# EAGLE schematic tottag (EAGLE 9.6.2)
AUTHOR: Andreas Biri & Pat Pannuto; REV: H; TITLE: TotTag

## Sheet 1 of 5: nRF8240
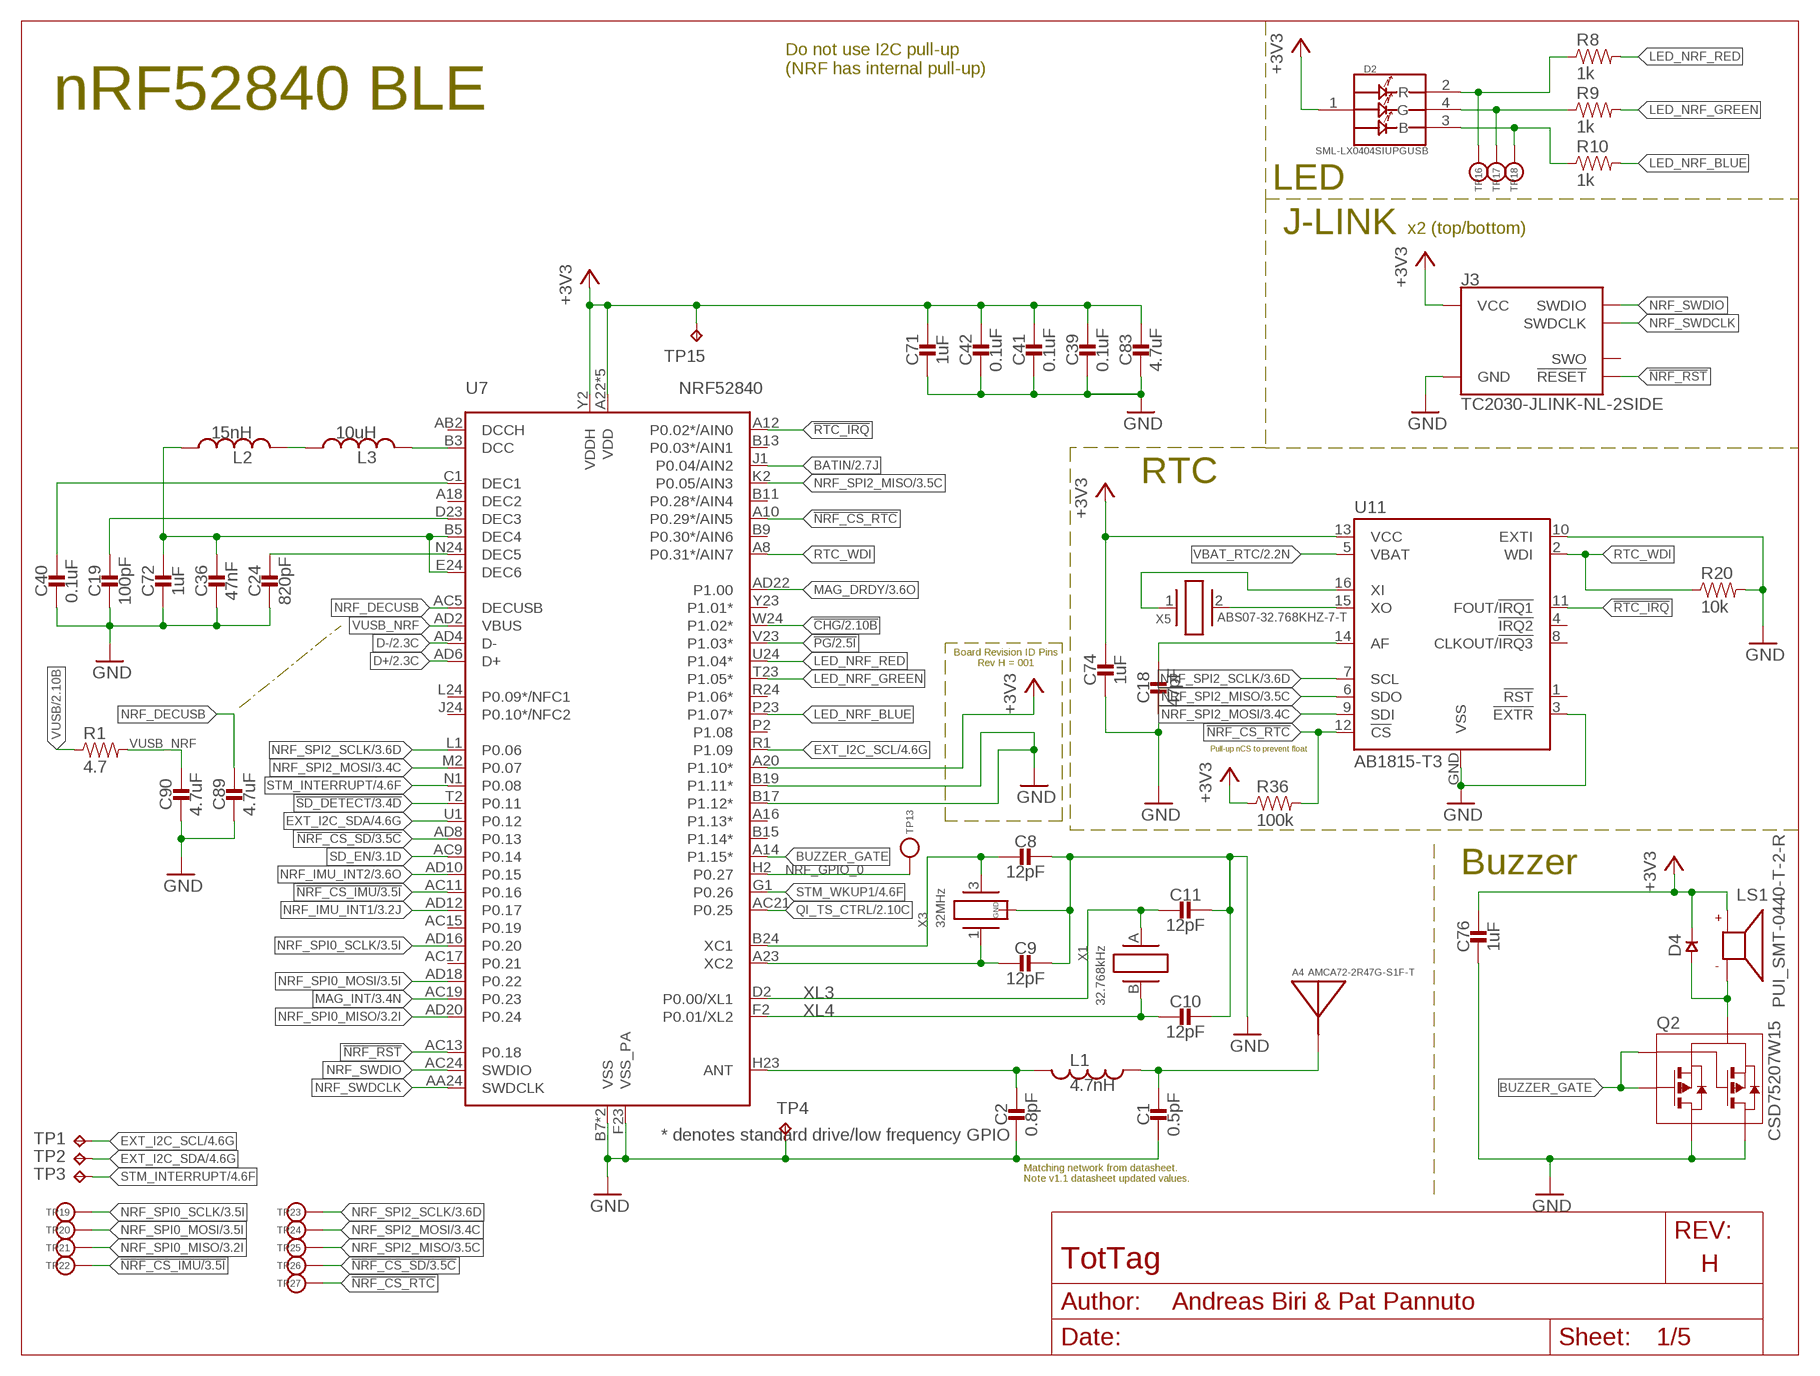
[diagram p0: schematic, sheet 1]

### Parts
A4  AMCA72-2R47G-S1F-T  [AMCA72-2R470G-S1F-T]
C1  0.5pF  CAPACITOR0402_CAP  [0402_CAP]
C2  0.8pF  CAPACITOR0402_CAP  [0402_CAP]
C8  12pF  CAPACITOR0402_CAP  [0402_CAP]
C9  12pF  CAPACITOR0402_CAP  [0402_CAP]
C10  12pF  CAPACITOR0402_CAP  [0402_CAP]
C11  12pF  CAPACITOR0402_CAP  [0402_CAP]
C18  47pF  CAPACITOR0402_CAP  [0402_CAP]
C19  100pF  CAPACITOR0402_CAP  [0402_CAP]
C24  820pF  CAPACITOR0402_CAP  [0402_CAP]
C36  47nF  CAPACITOR0402_CAP  [0402_CAP]
C39  0.1uF  CAPACITOR0402_CAP  [0402_CAP]
C40  0.1uF  CAPACITOR0402_CAP  [0402_CAP]
C41  0.1uF  CAPACITOR0402_CAP  [0402_CAP]
C42  0.1uF  CAPACITOR0402_CAP  [0402_CAP]
C71  1uF  CAPACITOR0402_CAP  [0402_CAP]
C72  1uF  CAPACITOR0402_CAP  [0402_CAP]
C74  1uF  CAPACITOR0402_CAP  [0402_CAP]
C76  1uF  CAPACITOR0402_CAP  [0402_CAP]
C83  4.7uF  CAPACITOR0402_CAP  [0402_CAP]
C89  4.7uF  CAPACITOR0402_CAP  [0402_CAP]
C90  4.7uF  CAPACITOR0402_CAP  [0402_CAP]
D2  SML-LX0404SIUPGUSB  [1MM_SQ_4PAD]
D4  DIODE0402  [0402_DIODE]
J3  TC2030-JLINK-NL-2SIDE  [TC2030-IDC-NL-2SIDE]
L1  4.7nH  INDUCTOR0402  [0402_CAP]
L2  15nH  INDUCTOR0402  [0402_CAP]
L3  10uH  INDUCTOR0603  [0603_CAP]
LS1  PUI_SMT-0440-T-2-R  [SMT-0440-T-2-R]
Q2  CSD75207W15  [DSBGA]
R1  4.7  RESISTOR0402_RES  [0402_RES]
R8  1k  RESISTOR0402_RES  [0402_RES]
R9  1k  RESISTOR0402_RES  [0402_RES]
R10  1k  RESISTOR0402_RES  [0402_RES]
R20  10k  RESISTOR0402_RES  [0402_RES]
R36  100k  RESISTOR0402_RES  [0402_RES]
TP1  TPTP06SQ  [TP06SQ]
TP2  TPTP06SQ  [TP06SQ]
TP3  TPTP06SQ  [TP06SQ]
TP4  TPTP06SQ  [TP06SQ]
TP13  TEST-POINT  [PAD.03X.03]
TP15  TPTP06SQ  [TP06SQ]
TP16  TEST-POINT  [PAD.03X.03]
TP17  TEST-POINT  [PAD.03X.03]
TP18  TEST-POINT  [PAD.03X.03]
TP19  TEST-POINT  [PAD.03X.03]
TP20  TEST-POINT  [PAD.03X.03]
TP21  TEST-POINT  [PAD.03X.03]
TP22  TEST-POINT  [PAD.03X.03]
TP23  TEST-POINT  [PAD.03X.03]
TP24  TEST-POINT  [PAD.03X.03]
TP25  TEST-POINT  [PAD.03X.03]
TP26  TEST-POINT  [PAD.03X.03]
TP27  TEST-POINT  [PAD.03X.03]
U7  NRF52840  [AQFN73]
U11  AB1815-T3  [QFN-16-3MM]
X1  32.768kHz  ABS05-32.768KHZ-9-T  [ABS05]
X3  32MHz  7V-32.000MAHV-T  [TXC-7V]
X5  ABS07-32.768KHZ-7-T  [ABS07]

### Nets
!CHG: U7.W24(P1.02*) ; also sheet 2
!NRF_CS_IMU: TP22.P$1(TESTPOINT) U7.AC11(P0.16) ; also sheet 3
!NRF_CS_RTC: R36.2 TP27.P$1(TESTPOINT) U7.A10(P0.29*/AIN5) U11.12(!CS)
!NRF_CS_SD: TP26.P$1(TESTPOINT) U7.AD8(P0.13) ; also sheet 3
!NRF_RST: J3.3(!RESET) J3.B3(!RESET) U7.AC13(P0.18)
!PG: U7.V23(P1.03*) ; also sheet 2
!RTC_IRQ: U7.A12(P0.02*/AIN0) U11.11(FOUT/!IRQ1)
!SD_DETECT: U7.T2(P0.11) ; also sheet 3
+3V3: C39.1 C41.1 C42.1 C71.1 C74.1 C76.1 C83.1 D2.1(VDD) D4.CATHODE J3.1(VCC) J3.B1(VCC) LS1.+(P) R36.1 TP15.TP U7.A20(P1.10*) U7.A22(VDD) U7.AD14(VDD) U7.AD23(VDD) U7.B1(VDD) U7.W1(VDD) U7.Y2(VDDH) U11.13(VCC) ; also sheet 2,3,4,5
BATIN: U7.J1(P0.04/AIN2) ; also sheet 2
BLE_ANT: A4.S1(ANTENNA) C1.1 L1.1
BUZZER_GATE: Q2.A1(G1) Q2.C1(G2) U7.A14(P1.15*)
D+: U7.AD6(D+) ; also sheet 2
D-: U7.AD4(D-) ; also sheet 2
EXT_I2C_SCL: TP1.TP U7.R1(P1.09) ; also sheet 4,5
EXT_I2C_SDA: TP2.TP U7.U1(P0.12) ; also sheet 4,5
GND: C1.2 C2.2 C8.1 C9.1 C10.1 C11.1 C18.2 C19.2 C24.2 C36.2 C39.2 C40.2 C41.2 C42.2 C71.2 C72.2 C74.2 C76.2 C83.2 C89.2 C90.2 J3.5(GND) J3.B5(GND) Q2.A2(D1) Q2.A3(D1) Q2.B2(D2) Q2.B3(D1) Q2.C2(D2) Q2.C3(D2) R20.2 TP4.TP U7.B7(VSS) U7.B17(P1.12*) U7.B19(P1.11*) U7.F23(VSS_PA) U7.GND(VSS) U11.3(!EXTR) U11.10(EXTI) U11.GND(VSS) X3.2(GND) X3.4(GND) ; also sheet 2,3,4
LED_NRF_BLUE: R10.2 U7.P23(P1.07*)
LED_NRF_BLUE_COMM: D2.3(B) R10.1 TP18.P$1(TESTPOINT)
LED_NRF_GREEN: R9.2 U7.T23(P1.05*)
LED_NRF_GREEN_COMM: D2.4(G) R9.1 TP17.P$1(TESTPOINT)
LED_NRF_RED: R8.2 U7.U24(P1.04*)
LED_NRF_RED_COMM: D2.2(R) R8.1 TP16.P$1(TESTPOINT)
MAG_DRDY: U7.AD22(P1.00) ; also sheet 3
MAG_INT: U7.AC19(P0.23) ; also sheet 3
N$2: D4.ANODE LS1.-(N) Q2.B1(S)
N$15: C2.1 L1.2 U7.H23(ANT)
N$18: C8.2 U7.B24(XC1) X3.3
N$19: C9.2 U7.A23(XC2) X3.1
N$35: C18.1 U11.14(AF)
N$37: L2.2 L3.1
N$41: U11.16(XI) X5.1
N$42: U11.15(XO) X5.2
NRF_DCC: L3.2 U7.B3(DCC)
NRF_DECAP1: C40.1 U7.C1(DEC1)
NRF_DECAP3: C19.1 U7.D23(DEC3)
NRF_DECAP5: C24.1 U7.N24(DEC5)
NRF_DECAP46: C36.1 C72.1 L2.1 U7.B5(DEC4) U7.E24(DEC6)
NRF_DECUSB: C89.1 U7.AC5(DECUSB)
NRF_GPIO_0: TP13.P$1(TESTPOINT) U7.H2(P0.27)
NRF_IMU_INT1: U7.AD12(P0.17) ; also sheet 3
NRF_IMU_INT2: U7.AD10(P0.15) ; also sheet 3
NRF_SPI0_MISO: TP21.P$1(TESTPOINT) U7.AD20(P0.24) ; also sheet 3
NRF_SPI0_MOSI: TP20.P$1(TESTPOINT) U7.AD18(P0.22) ; also sheet 3
NRF_SPI0_SCLK: TP19.P$1(TESTPOINT) U7.AD16(P0.20) ; also sheet 3
NRF_SPI2_MISO: TP25.P$1(TESTPOINT) U7.K2(P0.05/AIN3) U11.6(SDO) ; also sheet 3
NRF_SPI2_MOSI: TP24.P$1(TESTPOINT) U7.M2(P0.07) U11.9(SDI) ; also sheet 3
NRF_SPI2_SCLK: TP23.P$1(TESTPOINT) U7.L1(P0.06) U11.7(SCL) ; also sheet 3
NRF_SWDCLK: J3.4(SWDCLK) J3.B4(SWDCLK) U7.AA24(SWDCLK)
NRF_SWDIO: J3.2(SWDIO) J3.B2(SWDIO) U7.AC24(SWDIO)
QI_TS_CTRL: U7.AC21(P0.25) ; also sheet 2
RTC_WDI: R20.1 U7.A8(P0.31*/AIN7) U11.2(WDI)
SD_EN: U7.AC9(P0.14) ; also sheet 3
STM_INTERRUPT: TP3.TP U7.N1(P0.08) ; also sheet 4,5
STM_WKUP1: U7.G1(P0.26) ; also sheet 4
VBAT_RTC: U11.5(VBAT) ; also sheet 2
VUSB: R1.1 ; also sheet 2
VUSB_NRF: C90.1 R1.2 U7.AD2(VBUS)
XL3: C11.2 U7.D2(P0.00/XL1) X1.A
XL4: C10.2 U7.F2(P0.01/XL2) X1.B
Unconnected: J3.6(SWO) J3.B6(SWO) U7.A16(P1.13*) U7.A18(DEC2) U7.AB2(DCCH) U7.AC15(P0.19) U7.AC17(P0.21) U7.B9(P0.30*/AIN6) U7.B11(P0.28*/AIN4) U7.B13(P0.03*/AIN1) U7.B15(P1.14*) U7.J24(P0.10*/NFC2) U7.L24(P0.09*/NFC1) U7.P2(P1.08) U7.R24(P1.06*) U7.Y23(P1.01*) U11.1(!RST) U11.4(!IRQ2) U11.8(CLKOUT/!IRQ3)

### Notes on the sheet
- Do not use I2C pull-up
  (NRF has internal pull-up)
- nRF52840 BLE
- LED
- J-LINK | x2 (top/bottom)
- RTC
- Board Revision ID Pins
  Rev H = 001
- Pull-up nCS to prevent float
- Buzzer
- Matching network from datasheet.
  Note v1.1 datasheet updated values.

## Sheet 2 of 5: Power
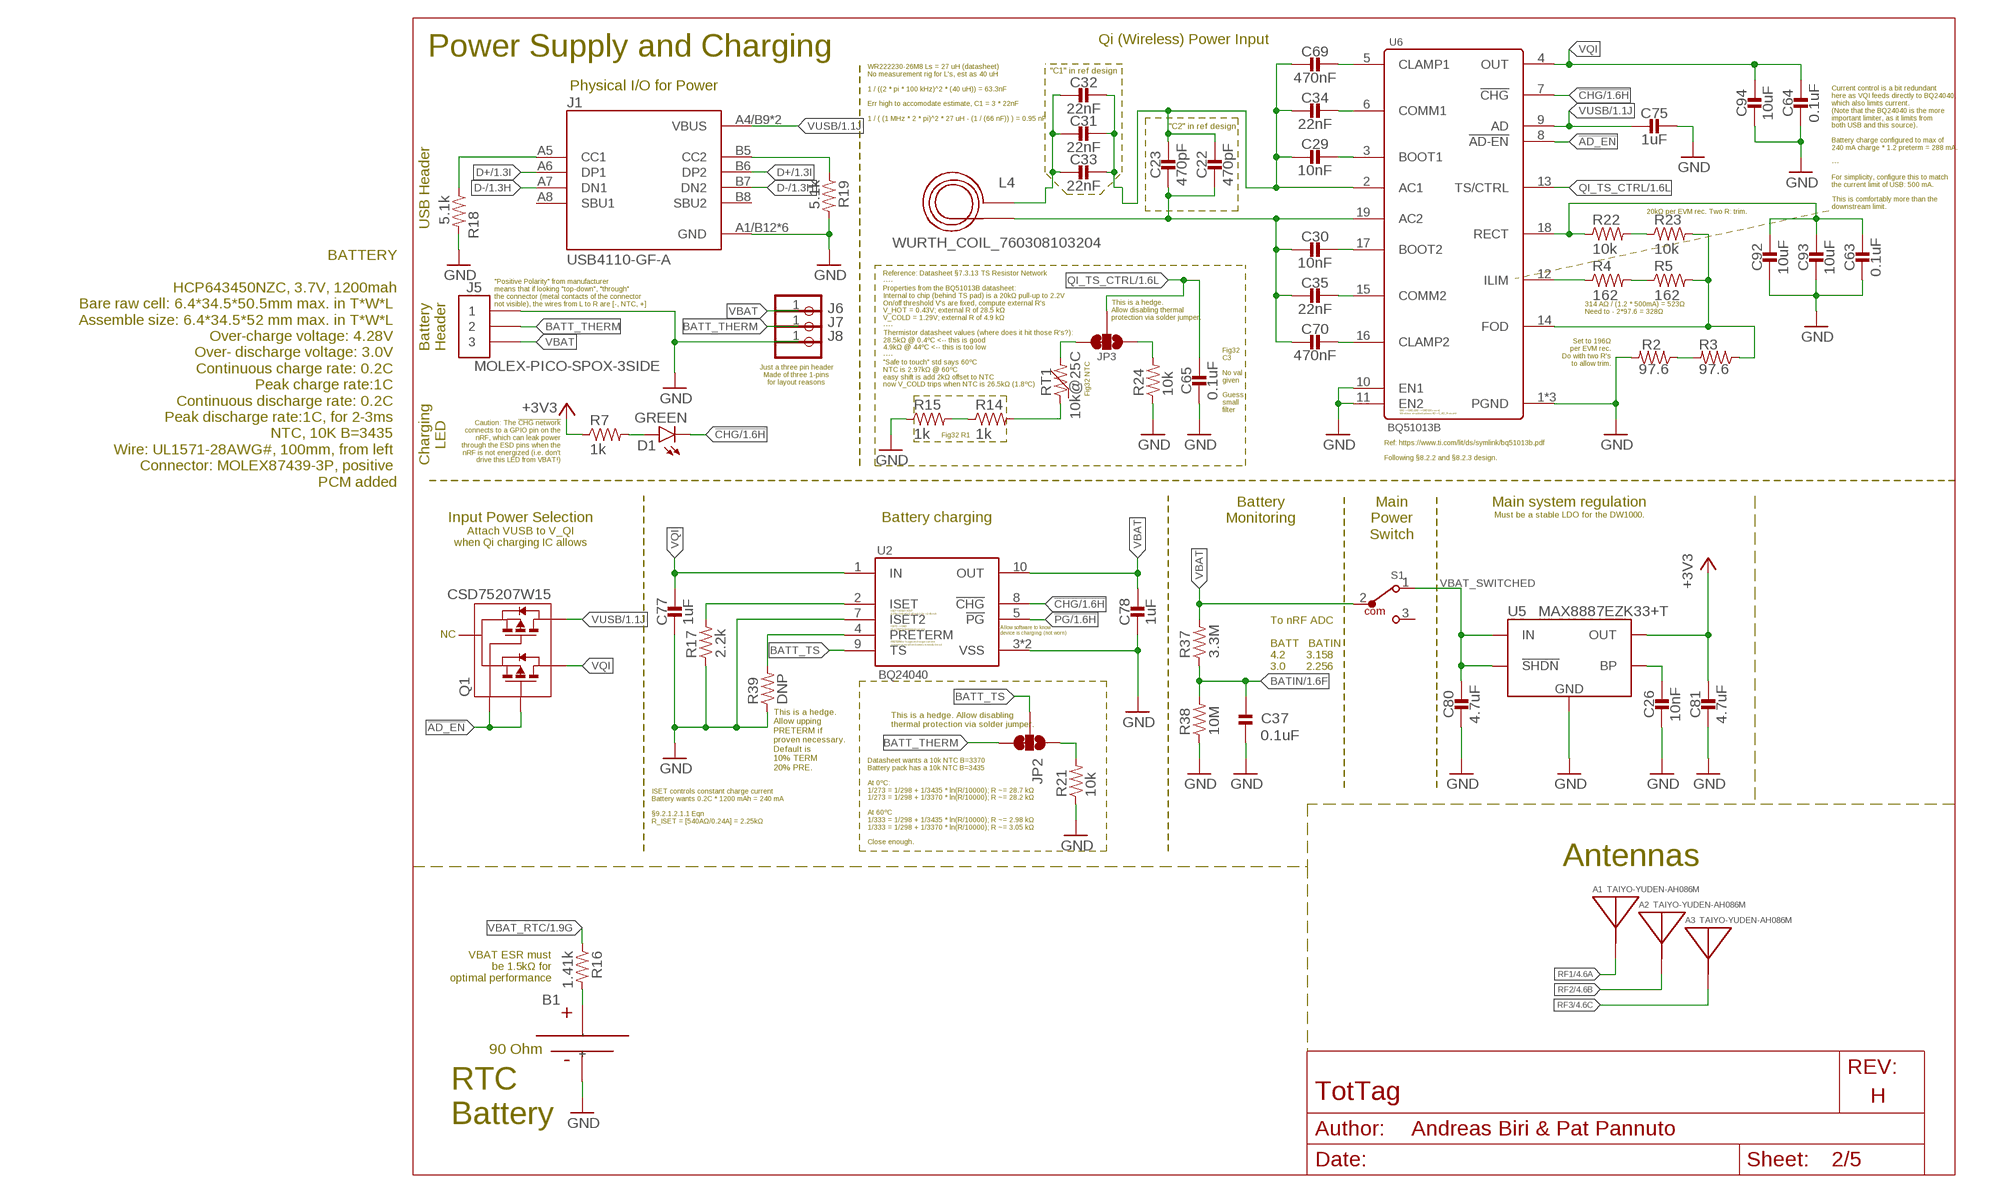
[diagram p1: schematic, sheet 2]

### Parts
A1  TAIYO-YUDEN-AH086M  [TAIYO-YUDEN-AH086M]
A2  TAIYO-YUDEN-AH086M  [TAIYO-YUDEN-AH086M]
A3  TAIYO-YUDEN-AH086M  [TAIYO-YUDEN-AH086M]
B1  MS518SE  [MS518SE-FL35E]
C22  470pF  CAPACITOR0402_CAP  [0402_CAP]
C23  470pF  CAPACITOR0402_CAP  [0402_CAP]
C26  10nF  CAPACITOR0402_CAP  [0402_CAP]
C29  10nF  CAPACITOR0402_CAP  [0402_CAP]
C30  10nF  CAPACITOR0402_CAP  [0402_CAP]
C31  22nF  CAPACITOR0402_CAP  [0402_CAP]
C32  22nF  CAPACITOR0402_CAP  [0402_CAP]
C33  22nF  CAPACITOR0402_CAP  [0402_CAP]
C34  22nF  CAPACITOR0402_CAP  [0402_CAP]
C35  22nF  CAPACITOR0402_CAP  [0402_CAP]
C37  0.1uF  CAPACITOR0402_CAP  [0402_CAP]
C63  0.1uF  CAPACITOR0402_CAP  [0402_CAP]
C64  0.1uF  CAPACITOR0402_CAP  [0402_CAP]
C65  0.1uF  CAPACITOR0402_CAP  [0402_CAP]
C69  470nF  CAPACITOR0402_CAP  [0402_CAP]
C70  470nF  CAPACITOR0402_CAP  [0402_CAP]
C75  1uF  CAPACITOR0402_CAP  [0402_CAP]
C77  1uF  CAPACITOR0402_CAP  [0402_CAP]
C78  1uF  CAPACITOR0402_CAP  [0402_CAP]
C80  4.7uF  CAPACITOR0402_CAP  [0402_CAP]
C81  4.7uF  CAPACITOR0402_CAP  [0402_CAP]
C92  10uF  CAPACITOR0603_CAP  [0603_CAP]
C93  10uF  CAPACITOR0603_CAP  [0603_CAP]
C94  10uF  CAPACITOR0603_CAP  [0603_CAP]
D1  GREEN  LED0603  [LED-0603]
J1  USB4110-GF-A  [GCT_USB4110-GF-A]
J5  MOLEX-PICO-SPOX-3SIDE  [MOLEX-PICO-SPOX-3_SIDE]
J6  PINHD-1X1  [1X01]
J7  PINHD-1X1  [1X01]
J8  PINHD-1X1  [1X01]
JP2  JUMPER-SMT_3_1-NC_TRACE_SILK  [SMT-JUMPER_3_1-NC_TRACE_SILK]
JP3  JUMPER-SMT_3_1-NC_TRACE_SILK  [SMT-JUMPER_3_1-NC_TRACE_SILK]
L4  WURTH_COIL_760308103204  [WURTH_COIL_760308103204]
Q1  CSD75207W15  [DSBGA]
R2  97.6  RESISTOR0402_RES  [0402_RES]
R3  97.6  RESISTOR0402_RES  [0402_RES]
R4  162  RESISTOR0402_RES  [0402_RES]
R5  162  RESISTOR0402_RES  [0402_RES]
R7  1k  RESISTOR0402_RES  [0402_RES]
R14  1k  RESISTOR0402_RES  [0402_RES]
R15  1k  RESISTOR0402_RES  [0402_RES]
R16  1.41k  RESISTOR0402_RES  [0402_RES]
R17  2.2k  RESISTOR0402_RES  [0402_RES]
R18  5.1k  RESISTOR0402_RES  [0402_RES]
R19  5.1k  RESISTOR0402_RES  [0402_RES]
R21  10k  RESISTOR0402_RES  [0402_RES]
R22  10k  RESISTOR0402_RES  [0402_RES]
R23  10k  RESISTOR0402_RES  [0402_RES]
R24  10k  RESISTOR0402_RES  [0402_RES]
R37  3.3M  RESISTOR0402_RES  [0402_RES]
R38  10M  RESISTOR0402_RES  [0402_RES]
R39  DNP  RESISTOR0402_RES  [0402_RES]
RT1  10k@25C  THERMISTOR0402  [0402_RES]
S1  450404015514  [450404015514]
U2  BQ24040  [DSQ0010A]
U5  MAX8887EZK33+T  [SOT-23-5]
U6  BQ51013B  [RHL0020A]

### Nets
!AD_EN: Q1.A1(G1) Q1.C1(G2) U6.8(!AD-EN)
!CHG: D1.C U2.8(!CHG) U6.7(!CHG) ; also sheet 1
!PG: U2.5(!PG) ; also sheet 1
+3V3: C81.1 R7.1 U5.5(OUT) ; also sheet 1,3,4,5
BATIN: C37.2 R37.1 R38.2 ; also sheet 1
BATT_THERM: J5.2 J5.2SUPP J7.1 JP2.3
BATT_TS: JP2.2 U2.9(TS)
BQ_AC1: C22.1 C23.1 C29.2 C31.1 C32.1 C33.1 C34.2 C69.2 U6.2(AC1)
BQ_AC2: C22.2 C23.2 C30.2 C35.2 C70.2 L4.P$2 U6.19(AC2)
BQ_BOOT1: C29.1 U6.3(BOOT1)
BQ_BOOT2: C30.1 U6.17(BOOT2)
BQ_CLAMP1: C69.1 U6.5(CLAMP1)
BQ_CLAMP2: C70.1 U6.16(CLAMP2)
BQ_COMM1: C34.1 U6.6(COMM1)
BQ_COMM2: C35.1 U6.15(COMM2)
BQ_FOD: R3.1 R5.2 R23.2 U6.14(FOD)
BQ_ILM: R4.1 U6.12(ILIM)
BQ_RECT: C63.1 C92.1 C93.1 R22.1 U6.18(RECT)
COIL_AC1: C31.2 C32.2 C33.2 L4.P$1
D+: J1.A6(DP1) J1.B6(DP2) ; also sheet 1
D-: J1.A7(DN1) J1.B7(DN2) ; also sheet 1
GND: B1.- C26.2 C37.1 C63.2 C64.2 C65.2 C75.1 C77.2 C78.2 C80.2 C81.2 C92.2 C93.2 C94.2 J1.A1/B12(GND) J1.B1/A12(GND) J1.S1(GND) J1.S2(GND) J1.S3(GND) J1.S4(GND) J5.1 J5.1SUPP J8.1 R2.2 R15.1 R17.1 R18.2 R19.2 R21.1 R24.1 R38.1 R39.1 U2.3(VSS) U2.7(ISET2) U2.PAD(VSS) U5.2(GND) U6.1(PGND) U6.10(EN1) U6.11(EN2) U6.20(PGND) U6.PAD(PGND) ; also sheet 1,3,4
N$1: J1.B5(CC2) R19.1
N$11: C26.1 U5.4(BP)
N$13: J1.A5(CC1) R18.1
N$28: R2.1 R3.2
N$34: R17.2 U2.2(ISET)
N$45: B1.+ R16.2
N$47: JP2.1 R21.2
N$49: R39.2 U2.4(PRETERM)
N$54: D1.A R7.2
N$64: R22.2 R23.1
N$66: R4.2 R5.1
N$67: JP3.1 R24.2
N$68: JP3.3 RT1.2
N$69: R14.2 RT1.1
N$70: R14.1 R15.2
QI_TS_CTRL: C65.1 JP3.2 U6.13(TS/CTRL) ; also sheet 1
RF1: A1.A(ANTENNA) ; also sheet 4,5
RF2: A2.A(ANTENNA) ; also sheet 4,5
RF3: A3.A(ANTENNA) ; also sheet 4,5
VBAT: C78.1 J5.3 J5.3SUPP J6.1 R37.2 S1.2 U2.10(OUT)
VBAT_RTC: R16.1 ; also sheet 1
VBAT_SWITCHED: C80.1 S1.1 U5.1(IN) U5.3(!SHDN)
VQI: C64.1 C77.1 C94.1 Q1.A2(D1) Q1.A3(D1) Q1.B3(D1) U2.1(IN) U6.4(OUT)
VUSB: C75.2 J1.A4/B9(VBUS) J1.B4/A9(VBUS) Q1.B2(D2) Q1.C2(D2) Q1.C3(D2) U6.9(AD) ; also sheet 1
Unconnected: J1.A8(SBU1) J1.B8(SBU2) Q1.B1(S) S1.3

### Notes on the sheet
- Power Supply and Charging | Qi (Wireless) Power Input
- WR222230-26M8 Ls = 27 uH (datasheet)
  No measurement rig for L's, est as 40 uH
  
  1 / ((2 * pi * 100 kHz)^2 * (40 uH)) = 63.3nF
  
  Err high to accomodate estimate, C1 = 3 * 22nF
  
  1 / ( (1 MHz * 2 * pi)^2 * 27 uH - (1 / (66 nF)) ) = 0.95 nF
- "C1" in ref design
- Physical I/O for Power
- "C2" in ref design
- USB Header
- 20kΩ per EVM rec. Two R: trim.
- Current control is a bit redundant
  here as VQI feeds directly to BQ24040,
  which also limits current.
  (Note that the BQ24040 is the more
  important limiter, as it limits from
  both USB and this source).
  
  Battery charge configured to max of
  240 mA charge * 1.2 preterm = 288 mA.
  
  ---
  
  For simplicity, configure this to match
  the current limit of USB: 500 mA.
  
  This is comfortably more than the
  downstream limit.
- BATTERY
  
  HCP643450NZC, 3.7V, 1200mah
  Bare raw cell: 6.4*34.5*50.5mm max. in T*W*L 
  Assemble size: 6.4*34.5*52 mm max. in T*W*L 
  Over-charge voltage: 4.28V 
  Over- discharge voltage: 3.0V 
  Continuous charge rate: 0.2C 
  Peak charge rate:1C 
  Continuous discharge rate: 0.2C 
  Peak discharge rate:1C, for 2-3ms 
  NTC, 10K B=3435 
  Wire: UL1571-28AWG#, 100mm, from left 
  Connector: MOLEX87439-3P, positive 
  PCM added
- Reference: Datasheet §7.3.13 TS Resistor Network
  ----
  Properties from the BQ51013B datasheet:
  Internal to chip (behind TS pad) is a 20kΩ pull-up to 2.2V
  On/off threshold V's are fixed, compute external R's
  V_HOT = 0.43V; external R of 28.5 kΩ
  V_COLD = 1.29V; external R of 4.9 kΩ
  ----
  Thermistor datasheet values (where does it hit those R's?):
  28.5kΩ @ 0.4ºC <-- this is good
  4.9kΩ @ 44ºC <-- this is too low
  ----
  "Safe to touch" std says 60ºC
  NTC is 2.97kΩ @ 60ºC
  easy shift is add 2kΩ offset to NTC
  now V_COLD trips when NTC is 26.5kΩ (1.8ºC)
- This is a hedge.
  Allow disabling thermal
  protection via solder jumper.
- 314 AΩ / (1.2 * 500mA) = 523Ω
  Need to - 2*97.6 = 328Ω
- "Positive Polarity" from manufacturer
  means that if looking "top-down", "through"
  the connector (metal contacts of the connector
  not visible), the wires from L to R are [-, NTC, +]
- Battery
  Header
- Set to 196Ω
  per EVM rec.
  Do with two R's
  to allow trim.
- Fig32
  C3
  
  No val
  given
  
  Guess
  small
  filter
- Just a three pin header
  Made of three 1-pins
  for layout reasons
- Fig32 NTC
- EN1 -> GND, EN2 -> GND [00 case]
  Wireless enabled unless AD > V_AD_Present
- Caution: The !CHG network
  connects to a GPIO pin on the
  nRF, which can leak power
  through the ESD pins when the
  nRF is not energized (i.e. don't
  drive this LED from VBAT!)
- Fig32 R1
- Charging
  LED
- Ref: https://www.ti.com/lit/ds/symlink/bq51013b.pdf
  
  Following §8.2.2 and §8.2.3 design.
- Battery
  Monitoring
- Main
  Power
  Switch
- Main system regulation
- Input Power Selection | Battery charging | Must be a stable LDO for the DW1000.
- Attach VUSB to V_QI
  when Qi charging IC allows
- ISET = KISET / IOUT
  2.25k = 540 AΩ / 240 mA; 2.2k -> 245 mA
- ISET2 -> GND
  Use ISET to limit input current
- Allow software to know
  device is charging (not worn)
- NC
- PRETERM is %age of charge current
  system uses when battery is totally dead
- To nRF ADC
  
  BATT   BATIN
  4.2       3.158
  3.0       2.256
- This is a hedge.
  Allow upping
  PRETERM if
  proven necessary.
  Default is
  10% TERM
  20% PRE.
- This is a hedge. Allow disabling
  thermal protection via solder jumper.
- Datasheet wants a 10k NTC B=3370
  Battery pack has a 10k NTC B=3435
  
  At 0ºC:
  1/273 = 1/298 + 1/3435 * ln(R/10000); R ~= 28.7 kΩ
  1/273 = 1/298 + 1/3370 * ln(R/10000); R ~= 28.2 kΩ
  
  At 60ºC
  1/333 = 1/298 + 1/3435 * ln(R/10000); R ~= 2.98 kΩ
  1/333 = 1/298 + 1/3370 * ln(R/10000); R ~= 3.05 kΩ
  
  Close enough.
- ISET controls constant charge current
  Battery wants 0.2C * 1200 mAh = 240 mA
  
  §9.2.1.2.1.1 Eqn
  R_ISET = [540AΩ/0.24A] = 2.25kΩ
- Antennas
- VBAT ESR must
  be 1.5kΩ for
  optimal performance
- 90 Ohm
- RTC
  Battery

## Sheet 3 of 5: SD Card + Sensors
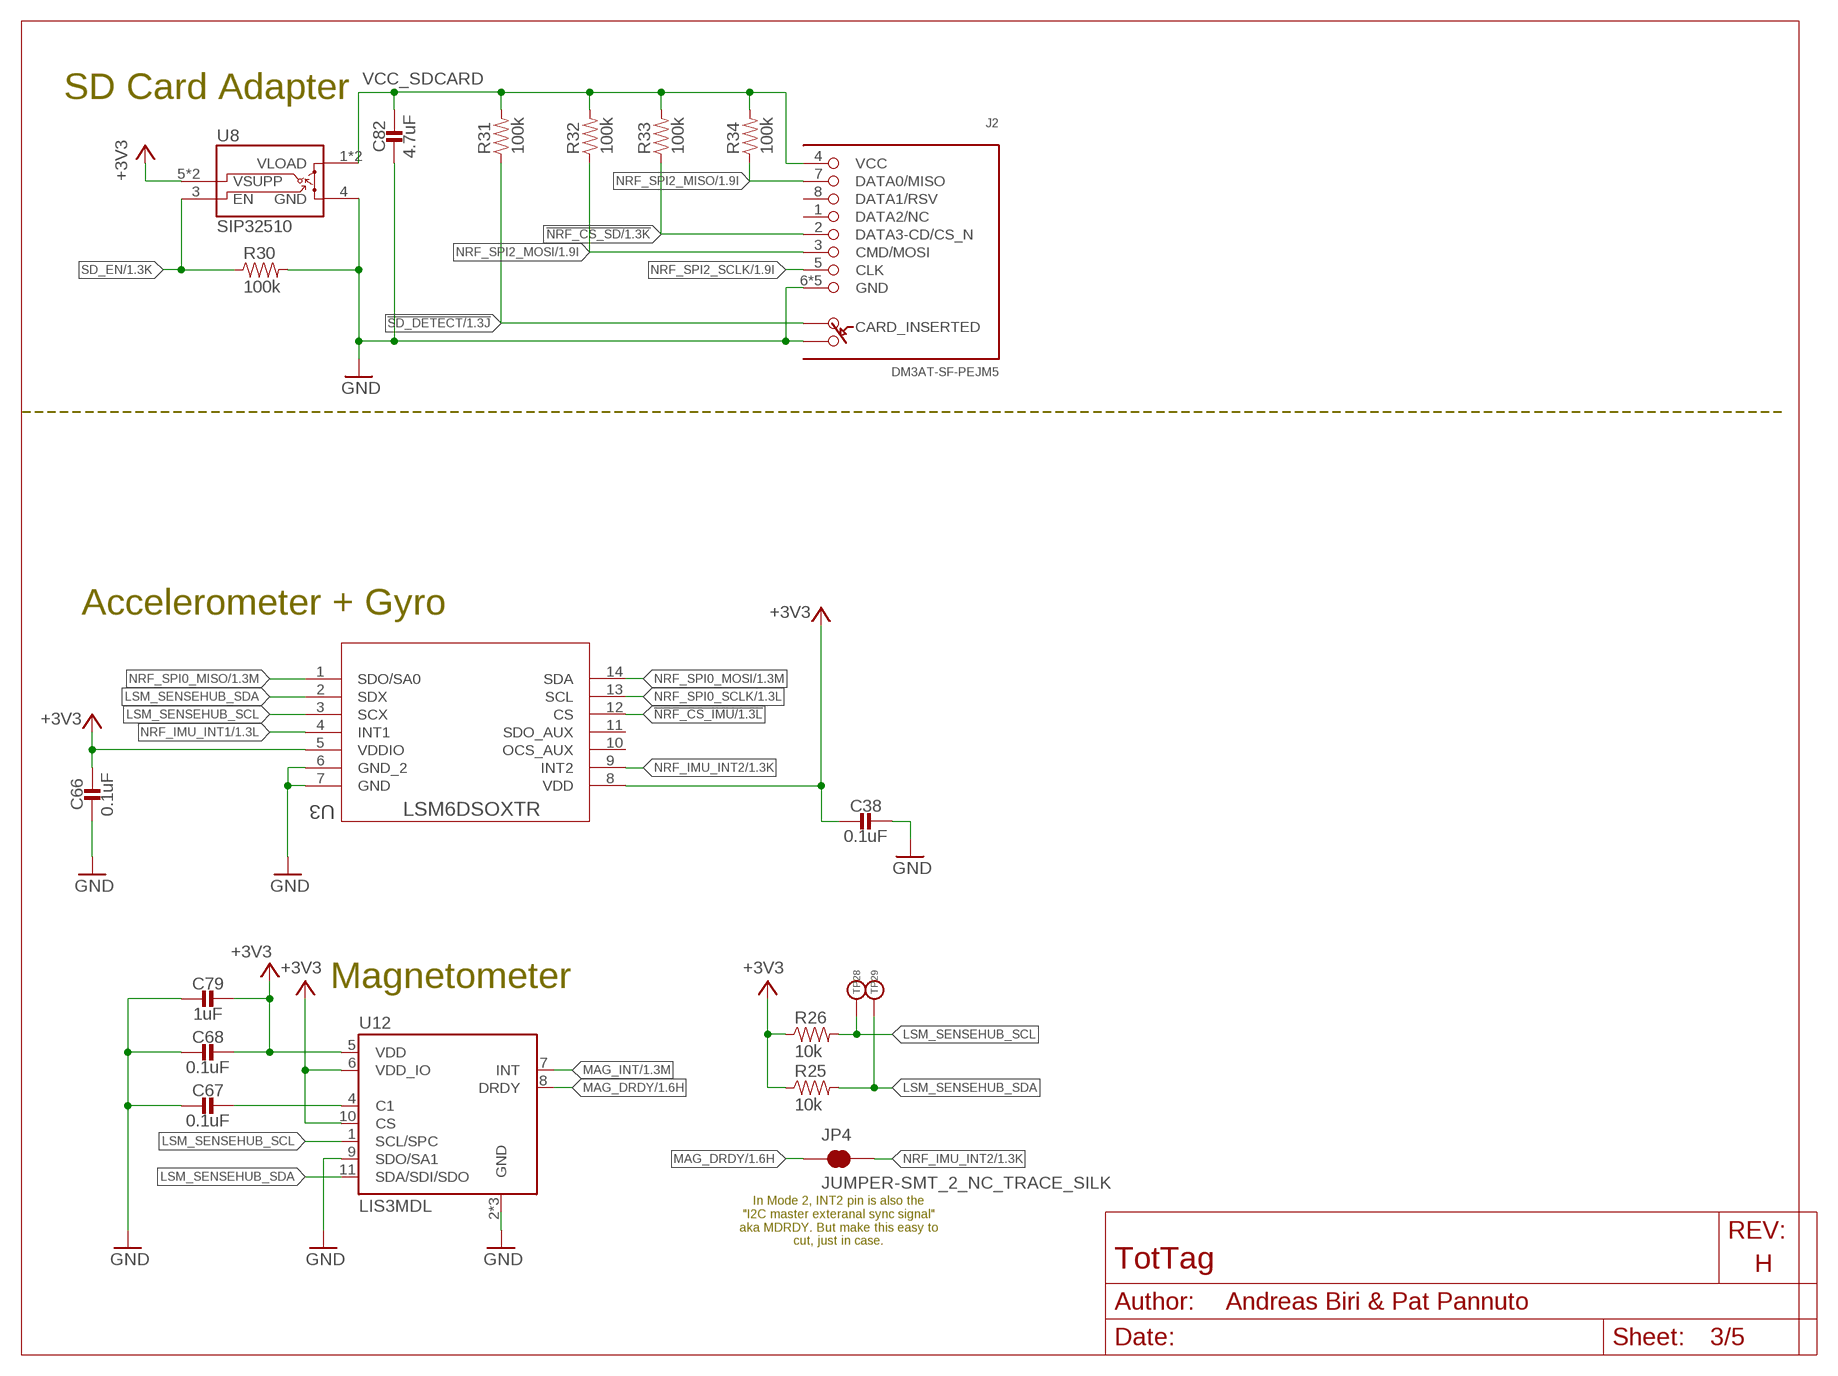
[diagram p2: schematic, sheet 3]

### Parts
C38  0.1uF  CAPACITOR0402_CAP  [0402_CAP]
C66  0.1uF  CAPACITOR0402_CAP  [0402_CAP]
C67  0.1uF  CAPACITOR0402_CAP  [0402_CAP]
C68  0.1uF  CAPACITOR0402_CAP  [0402_CAP]
C79  1uF  CAPACITOR0402_CAP  [0402_CAP]
C82  4.7uF  CAPACITOR0402_CAP  [0402_CAP]
J2  DM3AT-SF-PEJM5  [DM3AT-SF-PEJM5]
JP4  JUMPER-SMT_2_NC_TRACE_SILK  [SMT-JUMPER_2_NC_TRACE_SILK]
R25  10k  RESISTOR0402_RES  [0402_RES]
R26  10k  RESISTOR0402_RES  [0402_RES]
R30  100k  RESISTOR0402_RES  [0402_RES]
R31  100k  RESISTOR0402_RES  [0402_RES]
R32  100k  RESISTOR0402_RES  [0402_RES]
R33  100k  RESISTOR0402_RES  [0402_RES]
R34  100k  RESISTOR0402_RES  [0402_RES]
TP28  TEST-POINT  [PAD.03X.03]
TP29  TEST-POINT  [PAD.03X.03]
U3  LSM6DSOXTR  [LGA-14L_STM]
U8  SIP32510  [TSOT23-6]
U12  LIS3MDL  [LGA-12]

### Nets
!NRF_CS_IMU: U3.12(CS) ; also sheet 1
!NRF_CS_SD: J2.2(DATA3-CD/CS_N) R33.1 ; also sheet 1
!SD_DETECT: J2.A R31.1 ; also sheet 1
+3V3: C38.2 C66.1 C68.1 C79.1 R25.1 R26.1 U3.5(VDDIO) U3.8(VDD) U8.5(VSUPP) U8.6(VSUPP) U12.5(VDD) U12.6(VDD_IO) U12.10(CS) ; also sheet 1,2,4,5
GND: C38.1 C66.2 C67.2 C68.2 C79.2 C82.2 J2.6(GND) J2.B J2.MOUNT0(GND) J2.MOUNT1(GND) J2.MOUNT2(GND) J2.MOUNT3(GND) R30.2 U3.6(GND_2) U3.7(GND) U8.4(GND) U12.2(GND) U12.3(GND) U12.9(SDO/SA1) U12.12(GND) ; also sheet 1,2,4
LSM_SENSEHUB_SCL: R26.2 TP28.P$1(TESTPOINT) U3.3(SCX) U12.1(SCL/SPC)
LSM_SENSEHUB_SDA: R25.2 TP29.P$1(TESTPOINT) U3.2(SDX) U12.11(SDA/SDI/SDO)
MAG_DRDY: JP4.1 U12.8(DRDY) ; also sheet 1
MAG_INT: U12.7(INT) ; also sheet 1
N$33: C67.1 U12.4(C1)
NRF_IMU_INT1: U3.4(INT1) ; also sheet 1
NRF_IMU_INT2: JP4.2 U3.9(INT2) ; also sheet 1
NRF_SPI0_MISO: U3.1(SDO/SA0) ; also sheet 1
NRF_SPI0_MOSI: U3.14(SDA) ; also sheet 1
NRF_SPI0_SCLK: U3.13(SCL) ; also sheet 1
NRF_SPI2_MISO: J2.7(DATA0/MISO) R34.1 ; also sheet 1
NRF_SPI2_MOSI: J2.3(CMD/MOSI) R32.1 ; also sheet 1
NRF_SPI2_SCLK: J2.5(CLK) ; also sheet 1
SD_EN: R30.1 U8.3(EN) ; also sheet 1
VCC_SDCARD: C82.1 J2.4(VCC) R31.2 R32.2 R33.2 R34.2 U8.1(VLOAD) U8.2(VLOAD)
Unconnected: J2.1(DATA2/NC) J2.8(DATA1/RSV) U3.10(OCS_AUX) U3.11(SDO_AUX)

### Notes on the sheet
- SD Card Adapter
- Accelerometer + Gyro
- Magnetometer
- In Mode 2, INT2 pin is also the
  "I2C master exteranal sync signal"
  aka MDRDY. But make this easy to
  cut, just in case.

## Sheet 4 of 5: Localization module
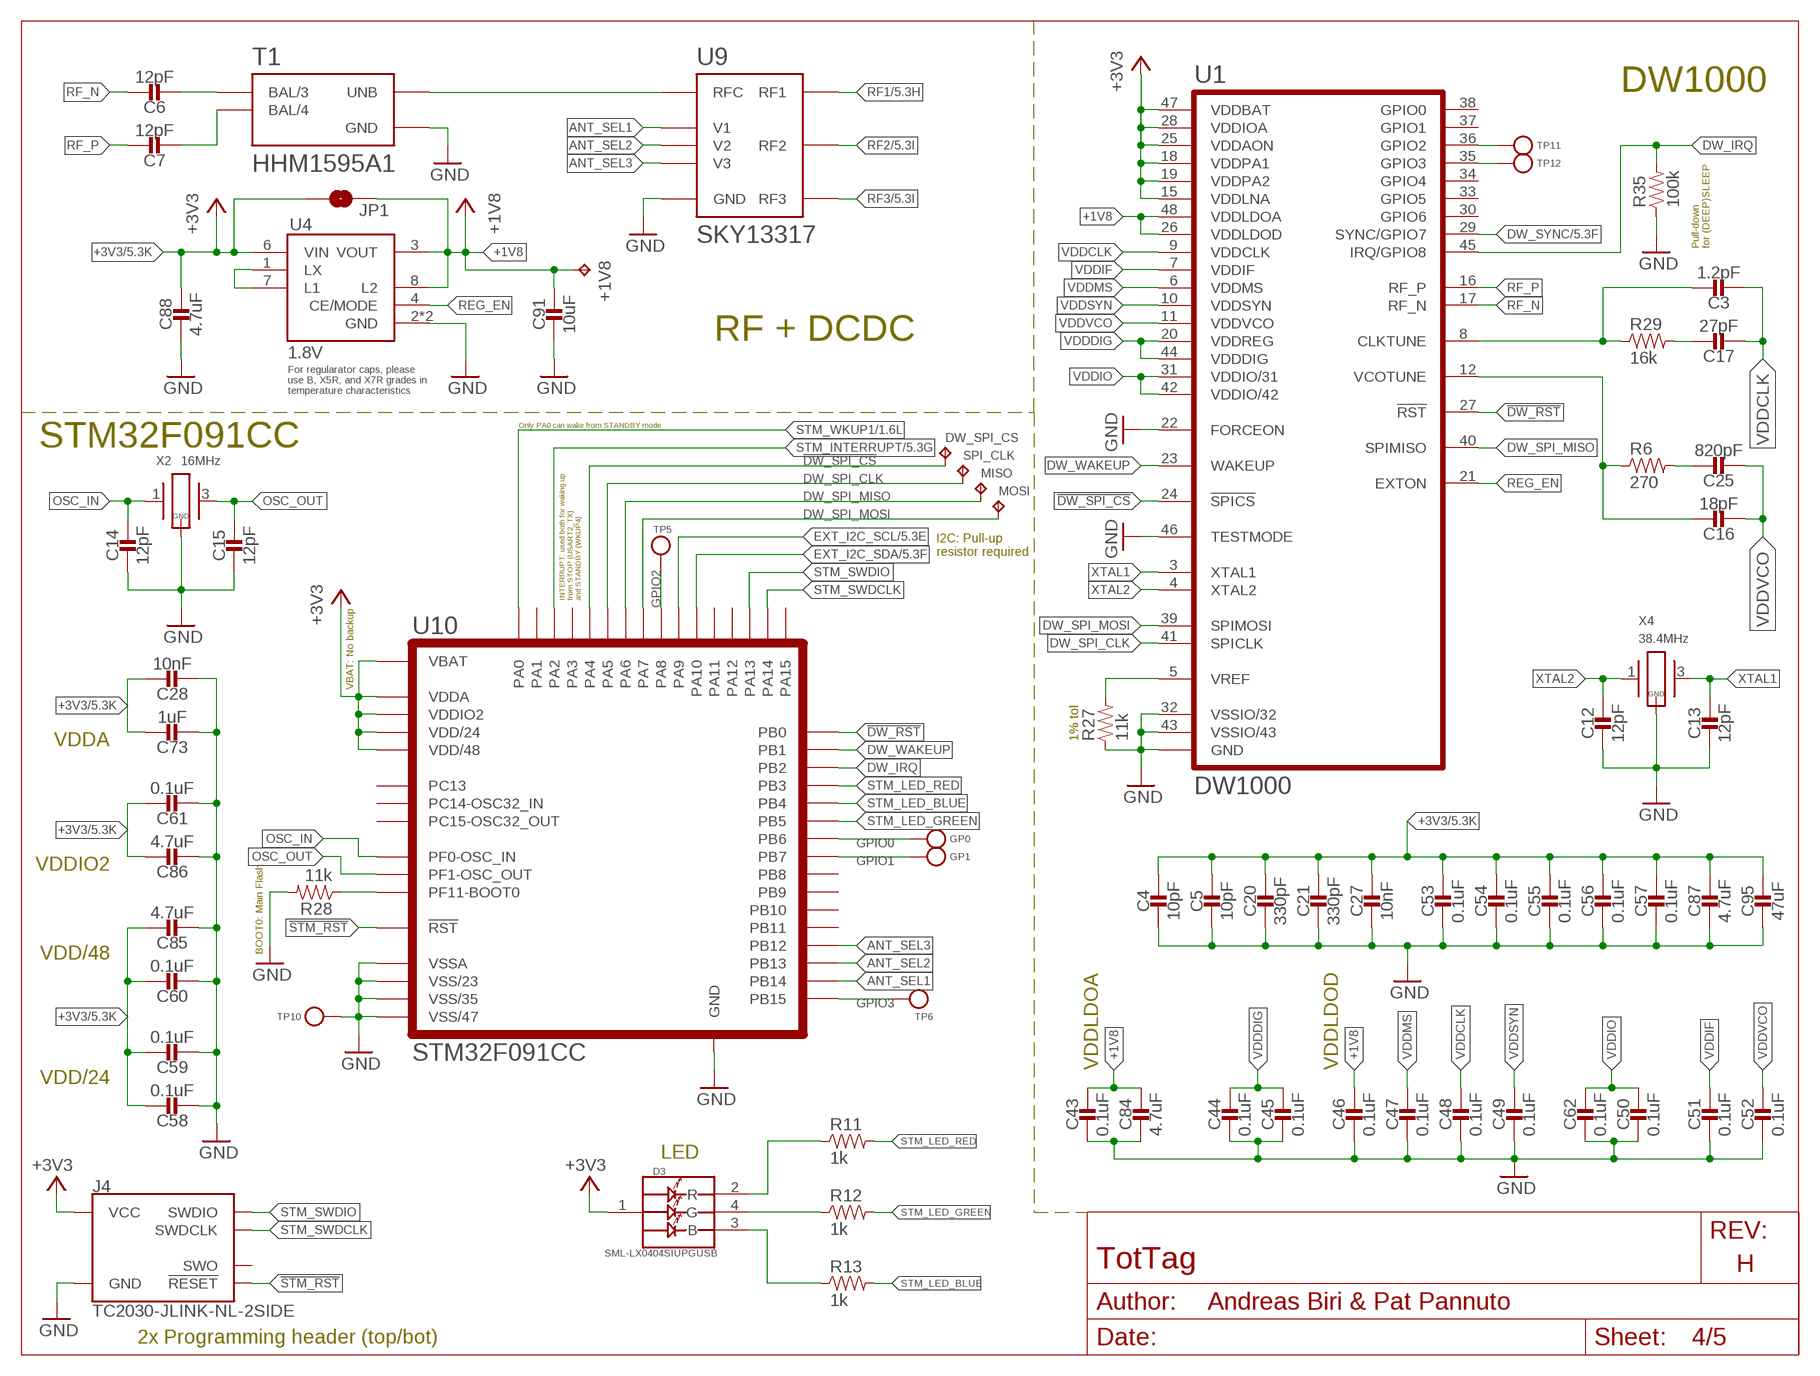
[diagram p3: schematic, sheet 4]

### Parts
+1V8  TPTP06SQ  [TP06SQ]
C3  1.2pF  CAPACITOR0402_CAP  [0402_CAP]
C4  10pF  CAPACITOR0402_CAP  [0402_CAP]
C5  10pF  CAPACITOR0402_CAP  [0402_CAP]
C6  12pF  CAPACITOR0201_CAP  [0201_CAP]
C7  12pF  CAPACITOR0201_CAP  [0201_CAP]
C12  12pF  CAPACITOR0402_CAP  [0402_CAP]
C13  12pF  CAPACITOR0402_CAP  [0402_CAP]
C14  12pF  CAPACITOR0402_CAP  [0402_CAP]
C15  12pF  CAPACITOR0402_CAP  [0402_CAP]
C16  18pF  CAPACITOR0402_CAP  [0402_CAP]
C17  27pF  CAPACITOR0402_CAP  [0402_CAP]
C20  330pF  CAPACITOR0402_CAP  [0402_CAP]
C21  330pF  CAPACITOR0402_CAP  [0402_CAP]
C25  820pF  CAPACITOR0402_CAP  [0402_CAP]
C27  10nF  CAPACITOR0402_CAP  [0402_CAP]
C28  10nF  CAPACITOR0402_CAP  [0402_CAP]
C43  0.1uF  CAPACITOR0402_CAP  [0402_CAP]
C44  0.1uF  CAPACITOR0402_CAP  [0402_CAP]
C45  0.1uF  CAPACITOR0402_CAP  [0402_CAP]
C46  0.1uF  CAPACITOR0402_CAP  [0402_CAP]
C47  0.1uF  CAPACITOR0402_CAP  [0402_CAP]
C48  0.1uF  CAPACITOR0402_CAP  [0402_CAP]
C49  0.1uF  CAPACITOR0402_CAP  [0402_CAP]
C50  0.1uF  CAPACITOR0402_CAP  [0402_CAP]
C51  0.1uF  CAPACITOR0402_CAP  [0402_CAP]
C52  0.1uF  CAPACITOR0402_CAP  [0402_CAP]
C53  0.1uF  CAPACITOR0402_CAP  [0402_CAP]
C54  0.1uF  CAPACITOR0402_CAP  [0402_CAP]
C55  0.1uF  CAPACITOR0402_CAP  [0402_CAP]
C56  0.1uF  CAPACITOR0402_CAP  [0402_CAP]
C57  0.1uF  CAPACITOR0402_CAP  [0402_CAP]
C58  0.1uF  CAPACITOR0402_CAP  [0402_CAP]
C59  0.1uF  CAPACITOR0402_CAP  [0402_CAP]
C60  0.1uF  CAPACITOR0402_CAP  [0402_CAP]
C61  0.1uF  CAPACITOR0402_CAP  [0402_CAP]
C62  0.1uF  CAPACITOR0402_CAP  [0402_CAP]
C73  1uF  CAPACITOR0402_CAP  [0402_CAP]
C84  4.7uF  CAPACITOR0402_CAP  [0402_CAP]
C85  4.7uF  CAPACITOR0402_CAP  [0402_CAP]
C86  4.7uF  CAPACITOR0402_CAP  [0402_CAP]
C87  4.7uF  CAPACITOR0402_CAP  [0402_CAP]
C88  4.7uF  CAPACITOR0402_CAP  [0402_CAP]
C91  10uF  CAPACITOR0603_CAP  [0603_CAP]
C95  47uF  CAPACITOR0603_CAP  [0603_CAP]
D3  SML-LX0404SIUPGUSB  [1MM_SQ_4PAD]
DW_SPI_CS  TPTP06SQ  [TP06SQ]
GP0  TEST-POINT  [PAD.03X.03]
GP1  TEST-POINT  [PAD.03X.03]
J4  TC2030-JLINK-NL-2SIDE  [TC2030-IDC-NL-2SIDE]
JP1  JUMPER-SMT_2_NO_SILK  [SMT-JUMPER_2_NO_SILK]
MISO  TPTP06SQ  [TP06SQ]
MOSI  TPTP06SQ  [TP06SQ]
R6  270  RESISTOR0402_RES  [0402_RES]
R11  1k  RESISTOR0402_RES  [0402_RES]
R12  1k  RESISTOR0402_RES  [0402_RES]
R13  1k  RESISTOR0402_RES  [0402_RES]
R27  11k  RESISTOR0402_RES  [0402_RES]
R28  11k  RESISTOR0402_RES  [0402_RES]
R29  16k  RESISTOR0402_RES  [0402_RES]
R35  100k  RESISTOR0402_RES  [0402_RES]
SPI_CLK  TPTP06SQ  [TP06SQ]
T1  HHM1595A1  [EIA-0805]
TP5  TEST-POINT  [PAD.03X.03]
TP6  TEST-POINT  [PAD.03X.03]
TP10  TEST-POINT  [PAD.03X.03]
TP11  TEST-POINT  [PAD.03X.03]
TP12  TEST-POINT  [PAD.03X.03]
U1  DW1000  [QFN-48-DW1000]
U4  1.8V  XCL206B  [XCL20X]
U9  SKY13317  [MLPQ-UT-8]
U10  STM32F091CC  [UFQFPN-48]
X2  16MHz  FA-20H  [FA-20H]
X4  38.4MHz  FA-20H  [FA-20H]

### Nets
!DW_RST: U1.27(!RST) U10.18(PB0)
!DW_SPI_CS: DW_SPI_CS.TP U1.24(!SPICS) U10.14(PA4)
!STM_RST: J4.3(!RESET) J4.B3(!RESET) U10.7(!RST)
+1V8: +1V8.TP C43.1 C46.1 C84.1 C91.1 JP1.2 U1.26(VDDLDOD) U1.48(VDDLDOA) U4.3(VOUT) U4.8(L2)
+3V3: C4.1 C5.1 C20.1 C21.1 C27.1 C28.1 C53.1 C54.1 C55.1 C56.1 C57.1 C58.1 C59.1 C60.1 C61.1 C73.1 C85.1 C86.1 C87.1 C88.1 C95.1 D3.1(VDD) J4.1(VCC) J4.B1(VCC) JP1.1 U1.15(VDDLNA) U1.18(VDDPA1) U1.19(VDDPA2) U1.25(VDDAON) U1.28(VDDIOA) U1.47(VDDBAT) U4.6(VIN) U10.1(VBAT) U10.9(VDDA) U10.24(VDD/24) U10.36(VDDIO2) U10.48(VDD/48) ; also sheet 1,2,3,5
ANT_SEL1: U9.3(V1) U10.27(PB14)
ANT_SEL2: U9.6(V2) U10.26(PB13)
ANT_SEL3: U9.7(V3) U10.25(PB12)
DW_IRQ: R35.2 U1.45(IRQ/GPIO8) U10.20(PB2)
DW_SPI_CLK: SPI_CLK.TP U1.41(SPICLK) U10.15(PA5)
DW_SPI_MISO: MISO.TP U1.40(SPIMISO) U10.16(PA6)
DW_SPI_MOSI: MOSI.TP U1.39(SPIMOSI) U10.17(PA7)
DW_SYNC: U1.29(SYNC/GPIO7) ; also sheet 5
DW_WAKEUP: U1.23(WAKEUP) U10.19(PB1)
EXT_I2C_SCL: U10.30(PA9) ; also sheet 1,5
EXT_I2C_SDA: U10.31(PA10) ; also sheet 1,5
GND: C4.2 C5.2 C12.2 C13.2 C14.2 C15.2 C20.2 C21.2 C27.2 C28.2 C43.2 C44.2 C45.2 C46.2 C47.2 C48.2 C49.2 C50.2 C51.2 C52.2 C53.2 C54.2 C55.2 C56.2 C57.2 C58.2 C59.2 C60.2 C61.2 C62.2 C73.2 C84.2 C85.2 C86.2 C87.2 C88.2 C91.2 C95.2 J4.5(GND) J4.B5(GND) R27.1 R28.2 R35.1 T1.2(GND) T1.5(GND) TP10.P$1(TESTPOINT) U1.22(FORCEON) U1.32(VSSIO/32) U1.43(VSSIO/43) U1.46(TESTMODE) U1.GND U4.2(GND) U4.5(GND) U9.GND U10.8(VSSA) U10.23(VSS/23) U10.35(VSS/35) U10.47(VSS/47) U10.GND X2.2(GND) X2.4(GND) X4.2(GND) X4.4(GND) ; also sheet 1,2,3
GPIO0: GP0.P$1(TESTPOINT) U10.42(PB6)
GPIO1: GP1.P$1(TESTPOINT) U10.43(PB7)
GPIO2: TP5.P$1(TESTPOINT) U10.29(PA8)
GPIO3: TP6.P$1(TESTPOINT) U10.28(PB15)
N$3: T1.1(UNB) U9.1(RFC)
N$4: C6.P$2 T1.3(BAL/3)
N$7: C7.P$2 T1.4(BAL/4)
N$8: C25.1 R6.2
N$12: C17.1 R29.2
N$14: C16.1 R6.1 U1.12(VCOTUNE)
N$16: C3.1 R29.1 U1.8(CLKTUNE)
N$21: R27.2 U1.5(VREF)
N$22: R28.1 U10.44(PF11-BOOT0)
N$26: TP11.P$1(TESTPOINT) U1.36(GPIO2)
N$27: TP12.P$1(TESTPOINT) U1.35(GPIO3)
N$44: U4.1(LX) U4.7(L1)
OSC_IN: C14.1 U10.5(PF0-OSC_IN) X2.1
OSC_OUT: C15.1 U10.6(PF1-OSC_OUT) X2.3
REG_EN: U1.21(EXTON) U4.4(CE/MODE)
RF1: U9.4(RF1) ; also sheet 2,5
RF2: U9.5(RF2) ; also sheet 2,5
RF3: U9.8(RF3) ; also sheet 2,5
RF_N: C6.P$1 U1.17(RF_N)
RF_P: C7.P$1 U1.16(RF_P)
STM_INTERRUPT: U10.12(PA2) ; also sheet 1,5
STM_LED_BLUE: R13.2 U10.40(PB4)
STM_LED_BLUE_COMM: D3.3(B) R13.1
STM_LED_GREEN: R12.2 U10.41(PB5)
STM_LED_GREEN_COMM: D3.4(G) R12.1
STM_LED_RED: R11.2 U10.39(PB3)
STM_LED_RED_COMM: D3.2(R) R11.1
STM_SWDCLK: J4.4(SWDCLK) J4.B4(SWDCLK) U10.37(PA14)
STM_SWDIO: J4.2(SWDIO) J4.B2(SWDIO) U10.34(PA13)
STM_WKUP1: U10.10(PA0) ; also sheet 1
VDDCLK: C3.2 C17.2 C48.1 U1.9(VDDCLK)
VDDDIG: C44.1 C45.1 U1.20(VDDREG) U1.44(VDDDIG)
VDDIF: C51.1 U1.7(VDDIF)
VDDIO: C50.1 C62.1 U1.31(VDDIO/31) U1.42(VDDIO/42)
VDDMS: C47.1 U1.6(VDDMS)
VDDSYN: C49.1 U1.10(VDDSYN)
VDDVCO: C16.2 C25.2 C52.1 U1.11(VDDVCO)
XTAL1: C13.1 U1.3(XTAL1) X4.3
XTAL2: C12.1 U1.4(XTAL2) X4.1
Unconnected: J4.6(SWO) J4.B6(SWO) U1.30(GPIO6) U1.33(GPIO5) U1.34(GPIO4) U1.37(GPIO1) U1.38(GPIO0) U10.2(PC13) U10.3(PC14-OSC32_IN) U10.4(PC15-OSC32_OUT) U10.11(PA1) U10.13(PA3) U10.21(PB10) U10.22(PB11) U10.32(PA11) U10.33(PA12) U10.38(PA15) U10.45(PB8) U10.46(PB9)

### Notes on the sheet
- DW1000
- Pull-down
  for (DEEP)SLEEP
- RF + DCDC
- For regularator caps, please
  use B, X5R, and X7R grades in
  temperature characteristics
- Only PA0 can wake from STANDBY mode
- STM32F091CC
- I2C: Pull-up
  resistor required
- INTERRUPT: used both for waking up
  from STOP (USART2_TX)
  and STANDBY (WKUP4)
- VBAT: No backup
- VDDA
- 1% tol
- VDDIO2
- VDD/48
- BOOT0: Main Flash
- VDD/24 | VDDLDOA | VDDLDOD
- LED
- 2x Programming header (top/bot)

## Sheet 5 of 5: External signals
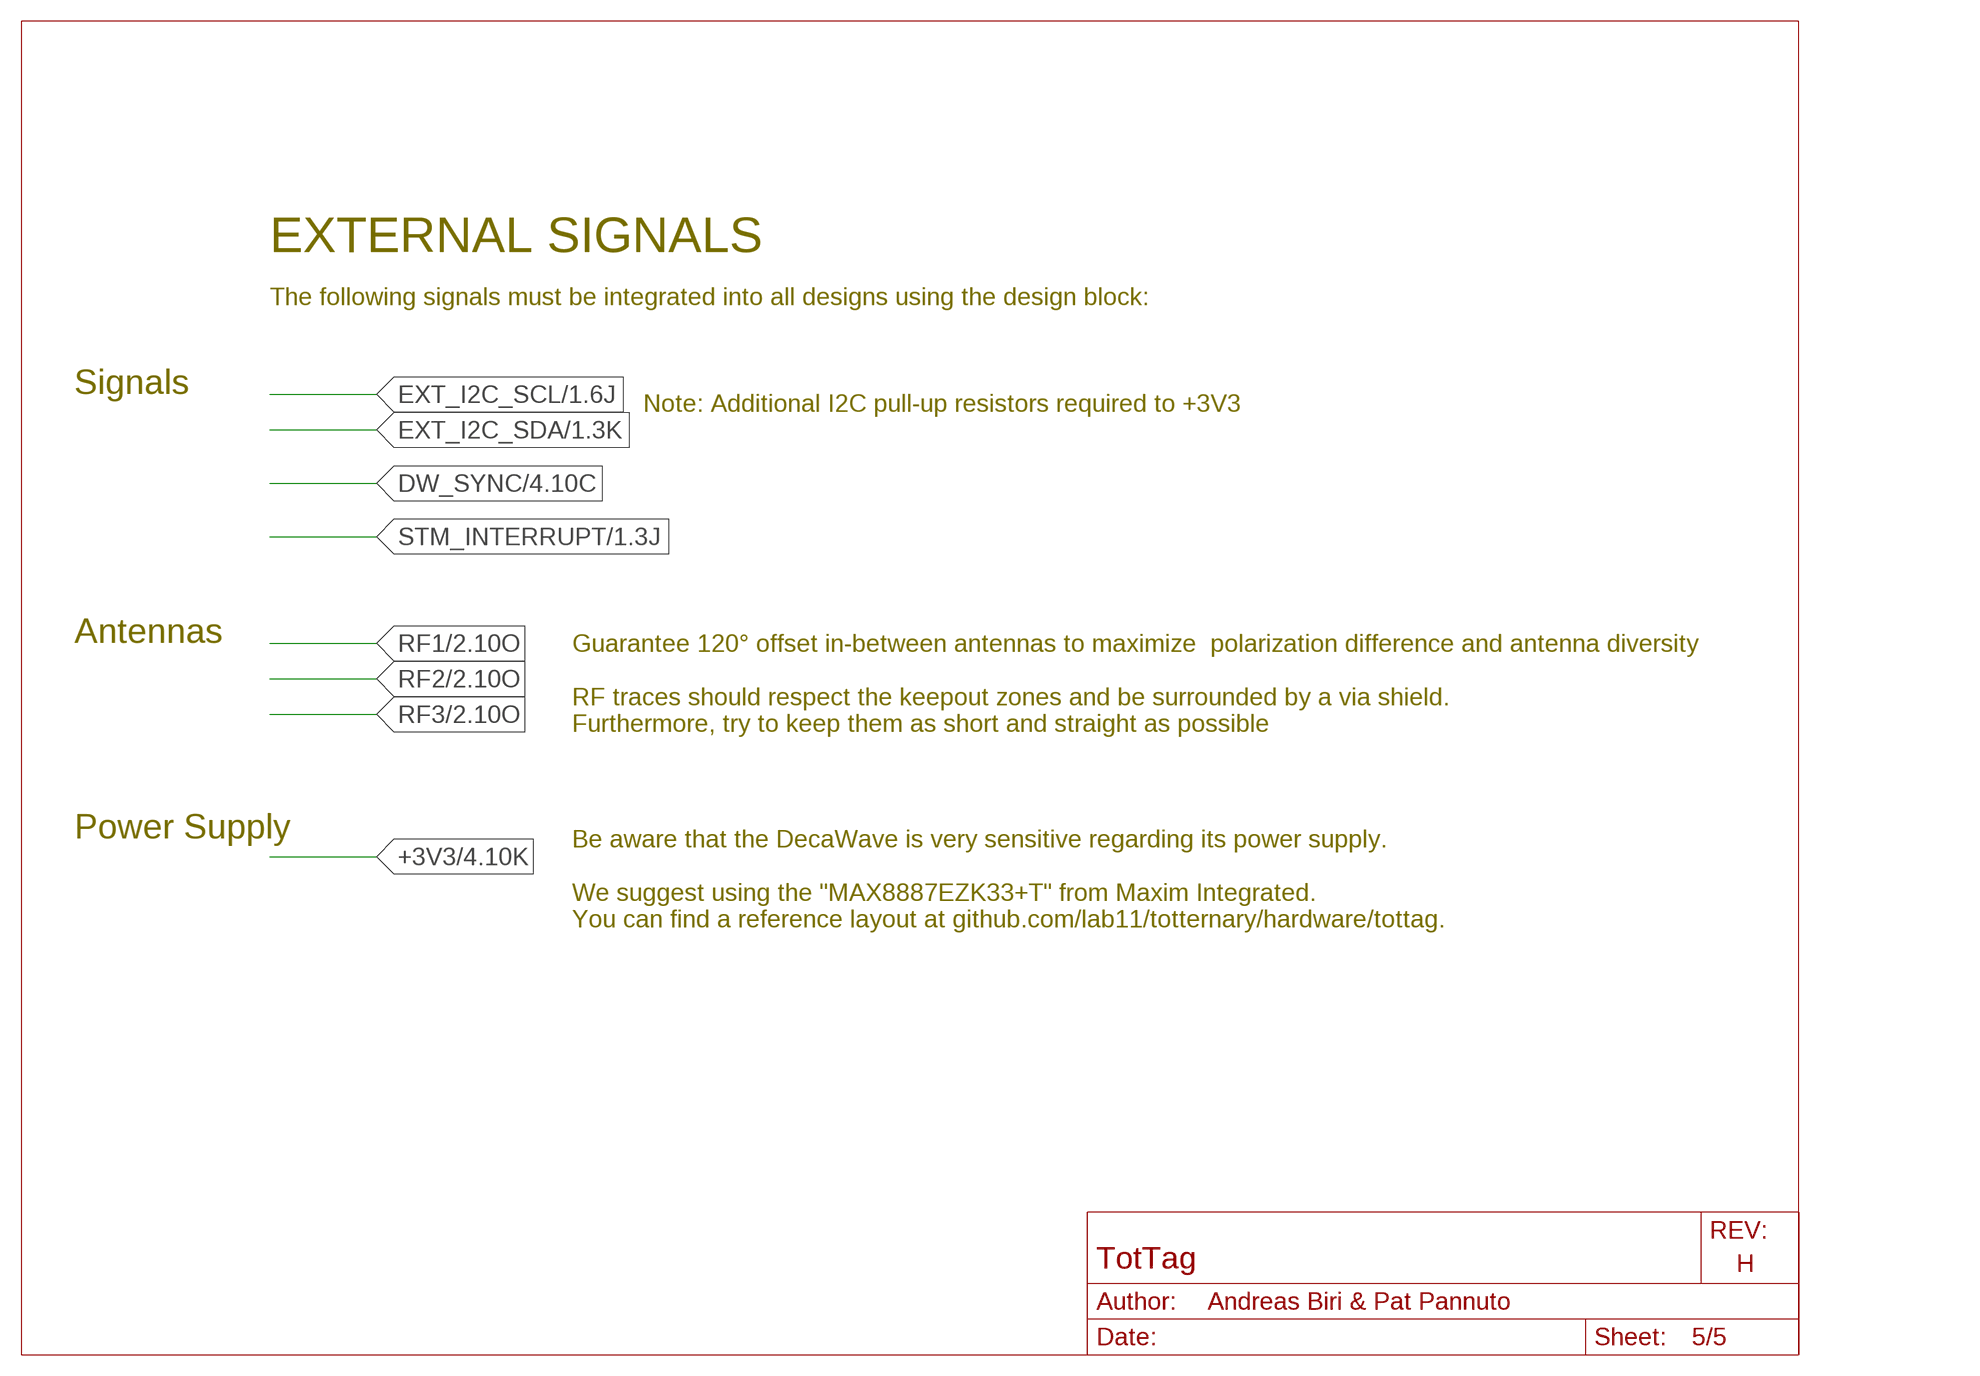
[diagram p4: schematic, sheet 5]

### Notes on the sheet
- EXTERNAL SIGNALS
- The following signals must be integrated into all designs using the design block:
- Signals
- Note: Additional I2C pull-up resistors required to +3V3
- Antennas
- Guarantee 120° offset in-between antennas to maximize  polarization difference and antenna diversity
  
  RF traces should respect the keepout zones and be surrounded by a via shield. 
  Furthermore, try to keep them as short and straight as possible
- Power Supply
- Be aware that the DecaWave is very sensitive regarding its power supply.
  
  We suggest using the "MAX8887EZK33+T" from Maxim Integrated.
  You can find a reference layout at github.com/lab11/totternary/hardware/tottag.

## Library data of the parts
+1V8 DW_SPI_CS MISO MOSI SPI_CLK TP1-TP4 TP15 = testpad:TP: Test pad
A1-A3 = antennas:TAIYO-YUDEN-AH086M: UWB Antenna - 3.1-8GHz; DIGIKEY: 587-2204-1-ND; MPN: AH086M555003-T
A4 = antennas:AMCA72-2R47G-S1F-T: WiFi/Bluetooth/ZigBee, ISM Atenna Abracon Page <https://abracon.com/parametric/antennas/AMCA72-2R470G-S1F-T>; DESCRIPTION: RF ANT 2.4GHZ CHIP SOLDER SMD; DIGIKEY: 535-14108-1-ND; MPN: AMCA72-2R470G-S1F-T4
B1 = batteries:MS518SE: A small, low leakage rechargeable battery for RTC backup; DIGIKEY: 728-1054-ND; MANUFACTURER: Seiko; MPN: MS518SE-FL35E
C1 = passives:CAPACITOR: SMD Capacitor; DIGIKEY: 490-11250-1-ND; MPN: GJM1555C1HR50WB01D
C2 = passives:CAPACITOR: SMD Capacitor; DIGIKEY: 490-11253-1-ND; MPN: GJM1555C1HR80WB01D
C3 = passives:CAPACITOR: SMD Capacitor; DIGIKEY: 490-3085-1-ND; MPN: GJM1555C1H1R2CB01D
C4 C5 = passives:CAPACITOR: SMD Capacitor; DIGIKEY: 732-12054-1-ND; MPN: 885012005074
C6 C7 = passives:CAPACITOR: SMD Capacitor; DIGIKEY: 399-8604-2-ND; MPN: CBR02C120F3GAC
C8-C15 = passives:CAPACITOR: SMD Capacitor; DIGIKEY: 399-8815-2-ND; MPN: CBR04C120F5GAC
C16 = passives:CAPACITOR: SMD Capacitor; DIGIKEY: 399-8828-1-ND; MPN: CBR04C180F5GAC
C17 = passives:CAPACITOR: SMD Capacitor; DIGIKEY: 490-16380-1-ND; MPN: GJM1555C1H270FB01D
C18 = passives:CAPACITOR: SMD Capacitor; DIGIKEY: 490-5942-1-ND; MPN: GRM1555C1H470JA01D
C19 = passives:CAPACITOR: SMD Capacitor; DIGIKEY: 490-5922-1-ND; MPN: GRM1555C1H101JA01D
C20 C21 = passives:CAPACITOR: SMD Capacitor; DIGIKEY: 311-3768-1-ND; MPN: CC0402JRX7R9BB331
C22 C23 = passives:CAPACITOR: SMD Capacitor; DESCRIPTION: CAP CER 470PF 50V C0G/NP0 0402; DIGIKEY: 490-6242-1-ND; MANUFACTURER: Murata; MPN: GRM1555C1H471JA01J
C24 C25 = passives:CAPACITOR: SMD Capacitor; DIGIKEY: 399-11129-2-ND; MPN: C0402C821J5GACTU
C26-C28 C37 C42-C62 C71 C73 C75 C80 C81 C83-C88 = passives:CAPACITOR: SMD Capacitor
C29 C30 = passives:CAPACITOR: SMD Capacitor; DIGIKEY: 490-6351-2-ND; MPN: GRM155R71H103KA88J
C31-C33 = passives:CAPACITOR: SMD Capacitor; DIGIKEY: 490-10699-2-ND; MPN: GRM155R71E223JA61D
C34 C35 = passives:CAPACITOR: SMD Capacitor; DIGIKEY: 311-3823-1-ND; MPN: CC0402ZRY5V8BB223
C36 = passives:CAPACITOR: SMD Capacitor; DIGIKEY: 445-1264-1-ND; MPN: C1005X7R1C473K050BC
C38-C41 C63-C68 = passives:CAPACITOR: SMD Capacitor; DIGIKEY: 490-6328-1-ND; MPN: GRM155R71C104KA88J
C69 C70 = passives:CAPACITOR: SMD Capacitor; DIGIKEY: 490-12270-1-ND; MPN: GRT155R61E474ME01D
C72 C74 C76-C79 = passives:CAPACITOR: SMD Capacitor; DIGIKEY: 490-7195-1-ND; MPN: GRM155R70G105KA12D
C82 C89 C90 = passives:CAPACITOR: SMD Capacitor; DESCRIPTION: CAP CER 4.7UF 6.3V X5R 0402; DIGIKEY: 445-5947-1-ND; MANUFACTURER: TDK; MPN: C1005X5R0J475K050BC
C91-C94 = passives:CAPACITOR: SMD Capacitor; DIGIKEY: 1253-CM105X5R106M25ATCT-ND; MPN: CM105X5R106M25AT
C95 = passives:CAPACITOR: SMD Capacitor; DIGIKEY: 490-13247-1-ND; MPN: GRM188R60J476ME15D
D1 = SparkFun-LED:LED: LED (Generic) Standard schematic elements and footprints for 5mm, 3mm, 1206, and 0603 sized LEDs. Generic LEDs with no color specified.; DIGIKEY: 160-1446-1-ND; MPN: LTST-C191KGKT
D2 D3 = leds:SML-LX0404SIUPGUSB: 1mm^2 RGB LED; DIGIKEY: 67-2125-1-ND; MANUFACTURER: Lumex Opto; MPN: SML-LX0404SIUPGUSB
D4 = passives:DIODE; DIGIKEY: 641-2087-1-ND; MPN: CDSQR400B-HF
GP0 GP1 TP5 TP6 TP10-TP13 TP16-TP29 = headers:TEST-POINT
J1 = connector:USB4110-GF-A: CONN USB 2.0 TYPE-C R/A SMT; DESCRIPTION: USB-C (USB TYPE-C) USB 2.0 Receptacle Connector 24 (16+8 Dummy) Position Surface Mount, Right Angle; Through Hole; DIGIKEY: 2073-USB4110-GF-A-1-ND; MF: GCT; MPN: USB4110-GF-A; PACKAGE: None
J2 = connector:DM3AT-SF-PEJM5: CONN MICRO SD R/A PUSH-PUSH SMD; DESCRIPTION: CONN MICRO SD CARD PUSH-PUSH R/A; DIGIKEY: HR1964CT-ND; MANUFACTURER: Hirose Electric Co Ltd; MPN: DM3AT-SF-PEJM5
J3 J4 = connector:TC2030-JLINK
J5 = connector:MOLEX-PICO-SPOX-3: MOLEX 1.50mm Pitch, Pico-SPOX PCB Header, Single Row, Surface Mount. Default connector of Shenzhen LiPo + Thermistor suppliers ca. 2020.; DIGIKEY: WM7647CT-ND; MFN: 874380343
J6-J8 = pinhead:PINHD-1X1: PIN HEADER
JP1 = SparkFun-Jumpers:JUMPER-SMT_2_NO: Normally open jumper This jumper has two pads in close proximity to each other. Apply solder to close the connection. Round pads are easier to solder for beginners, but are a lot larger. SparkFun Product that uses the round pads: SparkFun EL Sequencer <https://www.sparkfun.com/products/12781>
JP2 JP3 = SparkFun-Jumpers:JUMPER-SMT_3_1-NC_TRACE: Normally closed trace jumper (1 of 2 connections) This jumper has a trace between two pads so it's normally closed (NC). The other connection is normally open (NO). Use a razor knife to open the connection. For best results follow the IPC guidelines for cutting traces: Cutout at least 0.063 mm (0.005 in). Remove all loose material to clean up the cut area. Seal the cut with an approved epoxy. Reapply solder to reclose the connection, or to close the NO connection.
JP4 = SparkFun-Jumpers:JUMPER-SMT_2_NC_TRACE: Normally closed trace jumper This jumper has a trace between two pads so it's normally closed (NC). Use a razor knife to open the connection. For best results follow the IPC guidelines for cutting traces: Cutout at least 0.063 mm (0.005 in). Remove all loose material to clean up the cut area. Seal the cut with an approved epoxy. Reapply solder to reclose the connection.
L1 = passives:INDUCTOR: A very specific inductor; DIGIKEY: 490-15482-1-ND; MPN: LQW15AN4N7G8ZD
L2 = passives:INDUCTOR: A very specific inductor; DIGIKEY: 587-1521-1-ND; MPN: HK100515NJ-T
L3 = passives:INDUCTOR: A very specific inductor; DIGIKEY: 490-4025-1-ND; MPN: LQM18FN100M00D
L4 = ac:WURTH_COIL_760308103204; DIGIKEY: 732-5258-ND; MANUFACTURER: Würth Elektronik; MPN: 760308103204
LS1 = audio:PUI_SMT-0440-T-2-R; DIGIKEY: 668-SMT-0440-T-2-RTR-ND; MPN: SMT-0440-T-2-R
Q1 Q2 = fets:CSD75207W15: low on resistance, gate charge dual p-channel nexfet; DIGIKEY: 296-40008-1-ND; MANUFACTURER: TEXAS INSTRUMENTS; MPN: CSD75207W15
R1 = passives:RESISTOR: Resistor Basic schematic elements and footprints for 0201, 0402, 0603, 1206, and PTH resistors.; DIGIKEY: RMCF0402FT4R70CT-ND; MPN: RMCF0402FT4R70
R2 R3 = passives:RESISTOR: Resistor Basic schematic elements and footprints for 0201, 0402, 0603, 1206, and PTH resistors.; DIGIKEY: RMCF0402FT97R6CT-ND; MPN: RMCF0402FT97R6
R4 R5 = passives:RESISTOR: Resistor Basic schematic elements and footprints for 0201, 0402, 0603, 1206, and PTH resistors.; DIGIKEY: RMCF0402FT162RCT-ND; MPN: RMCF0402FT162R
R6 = passives:RESISTOR: Resistor Basic schematic elements and footprints for 0201, 0402, 0603, 1206, and PTH resistors.; DIGIKEY: RMCF0402FT270RCT-ND; MPN: RMCF0402FT270R
R7 R9-R15 R30-R36 R39 = passives:RESISTOR: Resistor Basic schematic elements and footprints for 0201, 0402, 0603, 1206, and PTH resistors.
R8 = passives:RESISTOR: Resistor Basic schematic elements and footprints for 0201, 0402, 0603, 1206, and PTH resistors.; DIGIKEY: RMCF0402FT1K00CT-ND; MPN: RMCF0402FT1K00
R16 = passives:RESISTOR: Resistor Basic schematic elements and footprints for 0201, 0402, 0603, 1206, and PTH resistors.; DIGIKEY: RMCF0402FT1K40CT-ND; MPN: RMCF0402FT1K40
R17 = passives:RESISTOR: Resistor Basic schematic elements and footprints for 0201, 0402, 0603, 1206, and PTH resistors.; DIGIKEY: RMCF0402JT2K20CT-ND; MPN: RMCF0402JT2K20
R18 R19 = passives:RESISTOR: Resistor Basic schematic elements and footprints for 0201, 0402, 0603, 1206, and PTH resistors.; DIGIKEY: RMCF0402FT5K10CT-ND; MPN: RMCF0402FT5K10
R20-R26 = passives:RESISTOR: Resistor Basic schematic elements and footprints for 0201, 0402, 0603, 1206, and PTH resistors.; DIGIKEY: 311-10KJRCT-ND; MPN: RC0402JR-0710KL
R27 R28 = passives:RESISTOR: Resistor Basic schematic elements and footprints for 0201, 0402, 0603, 1206, and PTH resistors.; DIGIKEY: RMCF0402FT11K0CT-ND; MPN: RMCF0402FT11K0
R29 = passives:RESISTOR: Resistor Basic schematic elements and footprints for 0201, 0402, 0603, 1206, and PTH resistors.; DIGIKEY: RMCF0402FT16K0CT-ND; MPN: RMCF0402FT16K0
R37 = passives:RESISTOR: Resistor Basic schematic elements and footprints for 0201, 0402, 0603, 1206, and PTH resistors.; DIGIKEY: RMCF0402FT3M30CT-ND; MPN: RMCF0402FT3M30
R38 = passives:RESISTOR: Resistor Basic schematic elements and footprints for 0201, 0402, 0603, 1206, and PTH resistors.; DIGIKEY: RMCF0402FT10M0CT-ND; MPN: RMCF0402FT10M0
RT1 = passives:THERMISTOR: Thermistor. Temperature-controller resistor.; DIGIKEY: 490-18149-1-ND; MPN: NCU15XH103F60RC
S1 = Wurth_Switch_WS-SLSU:450404015514: WS-SLSU Mini Slide Switch, Same Side Connection Side Push 6.7x2.7 mm Properties Actuator Material:PA46 Actuator Flammability Rating:UL94 HB Actuator Color:Black Frame Material:LCP Frame Flammability Rating:UL94 V-0 Frame Color:Black Contact Material:Copper Alloy Contact Plating:Silver Terminal Material:Copper Alloy Terminal Plating:Silver Switching Function:On-On Schematic:SPDT Connection Type:Same Side Connection Qty.:3300 Material Properties Cover Material:Stainless Steel General Information Operating Temperature:-40 up to +85 °C Packaging Properties Packaging :Tape and Reel <https://www.we-online.com/catalog/media/o76706v209%20Family_WS-SLSU_Gruppe.jpg> Details see: https://www.we-online.com/catalog/en/SLSU_6_7X_2_7_SMD_HORIZONTAL/ Updated by yingchun,Shan;2020-02-25 2020(C) Würth Elektronik; DATASHEET-URL: https://www.we-online.com/catalog/datasheet/450404015514.pdf; DIGIKEY: 732-13665-1-ND; IR: 300mA; PACKAGING: Tape and Reel; PART-NUMBER: 450404015514; QTY: 150; VR: 5V(DC)
T1 = rf:HHM1595A1: Description: Symbol for HHM1595A1 <https://product.tdk.com/info/en/documents/data_sheet/rf_balun_hhm1595a1_en.pdf>, a multilayer Balun from TDK.; DATASHEET: https://product.tdk.com/info/en/documents/data_sheet/rf_balun_hhm1595a1_en.pdf; DESCRIPTION: XFMR BALUN RF 3.0-8.0GHZ UWB SMD; DIGIKEY: 445-3387-1-ND; MANUFACTURER: TDK Corporation; MOUSER: 810-HHM1595A1; MPN: HHM1595A1
U1 = chips:DW1000: Description: The DecaWave DW1000 <https://www.decawave.com/sites/default/files/resources/dw1000-datasheet-v2.13.pdf> chip, used for UWB two-way ranging.; DATASHEET: https://www.decawave.com/sites/default/files/resources/dw1000-datasheet-v2.13.pdf; DESCRIPTION: IC RF TXRX 802.15.4 48-QFN; DIGIKEY: 1479-1001-1-ND; MANUFACTURER: Decawave Limited; MPN: DW1000-I-TR13
U2 = chips:BQ24040: Simple Li Ion / Li Poly charger.; DIGIKEY: 296-37142-1-ND; MPN: BQ24040DSQR
U3 = chips:LSM6DSOXTR; BUILT_BY: EMA_Cory; COPYRIGHT: Copyright (C) 2018 Accelerated Designs. All rights reserved; DATASHEET: https://www.st.com/resource/en/datasheet/lsm6dsox.pdf; DIGIKEY: 497-18367-1-ND; MPN: LSM6DSOXTR; SOURCELIBRARY: Updates_to_database_2020-11-03; VENDOR: STMicroelectronics
U4 = regulators:XCL206: Non-Isolated PoL Module DC DC Converter 1 Output 1.8V 600mA 2V - 6V Input; DIGIKEY: 893-1406-2-ND; MPN: XCL206B183CR-G
U5 = chips:MAX8887: IC REG LDO 3.3V 0.3A TSOT23-5; DIGIKEY: MAX8887EZK33+TCT-ND
U6 = chips:BQ51013B: bq51013B Highly Integrated Wireless Receiver Qi (WPC v1.2) Compliant Power Supply; DIGIKEY: 296-38885-1-ND; MPN: BQ51013BRHLR
U7 = chips:NRF52840: ultra-low power 2.4 GHz wireless system on chip (SoC) integrating a multiprotocol 2.4 GHz transceiver, an ARM® Cortex®-M4F CPU.; DIGIKEY: 1490-1071-1-ND; MANUFACTURER: NORIDIC SEMICONDUCTOR; MPN: NRF52840-QIAA-R
U8 = chips:SIP32510: Load switch, slew rate controlled. By Vishay; DIGIKEY: SIP32510DT-T1-GE3CT-ND; MANUFACTURER: Vishay; MPN: SIP32510DT-T1-GE3
U9 = switches:SKY13317: Description: Device for SKY13317-373LF <http://www.skyworksinc.com/uploads/documents/SKY13317_373LF_200914K.pdf>, an RF switch from Skyworks Inc.; DATASHEET: http://www.skyworksinc.com/uploads/documents/SKY13317_373LF_200914K.pdf; DESCRIPTION: IC SWITCH RF SP3T 8-MLP; DIGIKEY: 863-1056-1-ND; MANUFACTURER: Skyworks Solutions Inc.; MPN: SKY13317-373LF
U10 = chips:STM32F091CC: Description: STM32F091CC <https://www.st.com/resource/en/datasheet/stm32f091cc.pdf> from STMicroelectronics, an ARM-based 32-bit MCU with 256 kB Flash, 32kB of SRAM and a Cortex M0; DATASHEET: https://www.st.com/resource/en/datasheet/stm32f091cc.pdf; DESCRIPTION: IC MCU 32BIT 256KB FLASH 48QFPN; DIGIKEY: 497-15813-ND; MANUFACTURER: STMicroelectronics; MOUSER: 511-STM32F091CCU6; MPN: STM32F091CCU6
U11 = chips:AB1815-T3: Ultra-low current RTC. 55nA quiescent @ 3V. 1.5-3.6V input.; DIGIKEY: 535-11936-1-ND; MANUFACTURER: Abracon; MPN: AB1815-T3
U12 = chips:LIS3MDL; DIGIKEY: 497-13892-1-ND; MANUFACTURER: STM; MPN: LIS3MDLTR
X1 = crystals:ABS05-32.768KHZ: 32.768kHz Crystal; DIGIKEY: 535-11897-1-ND; MANUFACTURER: Abracon; MPN: ABS05-32.768KHZ-9-T
X2 = crystals:FA-20H: Description: Oscillator by EPSON from 12MHz to 54 MHz; DATASHEET: https://support.epson.biz/td/api/doc_check.php?dl=brief_FA-20H_en.pdf; DESCRIPTION: 16MHz ±10ppm Crystal 8pF 80 Ohms 4-SMD, No Lead; DIGIKEY: SER3913CT-ND; MANUFACTURER: EPSON; MPN: FA-20H 16.0000MF10Z-AJ3
X3 = crystals:7V: TXC CRYSTAL SMD; DIGIKEY: 887-2568-1-ND; MANUFACTURER: TXC CORPORATION; MPN: 7M-32.000MAHV-T
X4 = crystals:FA-20H: Description: Oscillator by EPSON from 12MHz to 54 MHz; DATASHEET: https://support.epson.biz/td/api/doc_check.php?dl=brief_FA-20H_en.pdf; DESCRIPTION: 38.4MHz ±10ppm Crystal 8.5pF 40 Ohms 4-SMD, No Lead; DIGIKEY: SER3631CT-ND; MANUFACTURER: EPSON; MPN: FA-20H 38.4000MF10Z-AS3
X5 = crystals:ABS07-32.768KHZ: 32.768kHz Crystal; DIGIKEY: 535-9543-1-ND; MANUFACTURER: ABRACON; MPN: ABS07-32.768KHZ-7-T